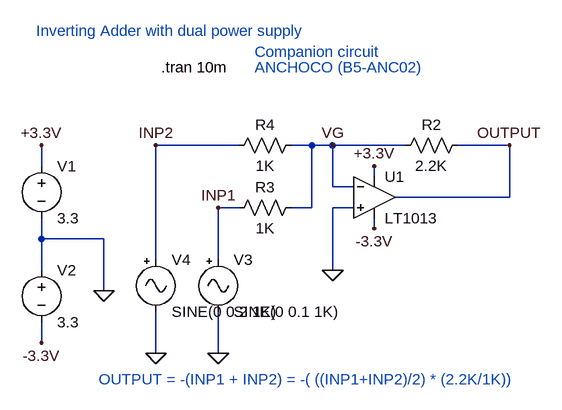
[diagram p0: schematic inverting_adder_with_dual_pow.asc]
inverting_adder_with_dual_pow.asc, the LTspice schematic file:
Version 4
SHEET 1 948 680
WIRE -240 0 -368 0
WIRE -128 0 -160 0
WIRE -96 0 -128 0
WIRE 16 0 -96 0
WIRE 176 0 96 0
WIRE -544 32 -544 0
WIRE -32 48 -32 32
WIRE -96 64 -96 0
WIRE -64 64 -96 64
WIRE 176 80 176 0
WIRE 176 80 0 80
WIRE -240 96 -272 96
WIRE -128 96 -128 0
WIRE -128 96 -160 96
WIRE -64 96 -96 96
WIRE -32 128 -32 112
WIRE -544 144 -544 112
WIRE -448 144 -544 144
WIRE -368 176 -368 0
WIRE -272 176 -272 96
WIRE -544 192 -544 144
WIRE -96 192 -96 96
WIRE -448 224 -448 144
WIRE -544 304 -544 272
WIRE -368 320 -368 256
WIRE -272 320 -272 256
FLAG -448 224 0
FLAG -544 0 +3.3V
FLAG -544 304 -3.3V
FLAG -32 32 +3.3V
FLAG -32 128 -3.3V
FLAG -272 320 0
FLAG 176 0 OUTPUT
FLAG -96 192 0
FLAG -368 320 0
FLAG -272 96 INP1
FLAG -368 0 INP2
FLAG -96 0 VG
SYMBOL voltage -544 16 R0
WINDOW 123 0 0 Left 0
WINDOW 39 0 0 Left 0
SYMATTR InstName V1
SYMATTR Value 3.3
SYMBOL voltage -544 176 R0
WINDOW 123 0 0 Left 0
WINDOW 39 0 0 Left 0
SYMATTR InstName V2
SYMATTR Value 3.3
SYMBOL res 0 16 R270
WINDOW 0 32 56 VTop 2
WINDOW 3 0 56 VBottom 2
SYMATTR InstName R2
SYMATTR Value 2.2K
SYMBOL Misc\\signal -272 160 R0
WINDOW 123 0 0 Left 0
WINDOW 39 0 0 Left 0
SYMATTR InstName V3
SYMATTR Value SINE(0 0.1 1K)
SYMBOL Opamps\\LT1013 -32 16 R0
SYMATTR InstName U1
SYMBOL Misc\\signal -368 160 R0
WINDOW 123 0 0 Left 0
WINDOW 39 0 0 Left 0
SYMATTR InstName V4
SYMATTR Value SINE(0 0.2 1K)
SYMBOL res -144 80 R90
WINDOW 0 0 56 VBottom 2
WINDOW 3 32 56 VTop 2
SYMATTR InstName R3
SYMATTR Value 1K
SYMBOL res -144 -16 R90
WINDOW 0 0 56 VBottom 2
WINDOW 3 32 56 VTop 2
SYMATTR InstName R4
SYMATTR Value 1K
TEXT -360 -120 Left 2 !.tran 10m
TEXT -552 -176 Left 2 ;Inverting Adder with dual power supply
TEXT -216 -120 Left 2 ;ANCHOCO (B5-ANC02)
TEXT -216 -144 Left 2 ;Companion circuit
TEXT -456 360 Left 2 ;OUTPUT = -(INP1 + INP2) = -( ((INP1+INP2)/2) * (2.2K/1K))

The netlist it stands for:
* inverting_adder_with_dual_pow.asc
V1 +3.3V 0 3.3
V2 0 -3.3V 3.3
R2 VG OUTPUT 2.2K
V3 INP1 0 SINE(0 0.1 1K)
XU1 0 VG +3.3V -3.3V OUTPUT LT1013  ; pins In+ In- V+ V- OUT
V4 INP2 0 SINE(0 0.2 1K)
R3 VG INP1 1K
R4 VG INP2 1K
.tran 10m
* Inverting Adder with dual power supply
* ANCHOCO (B5-ANC02)
* Companion circuit
* OUTPUT = -(INP1 + INP2) = -( ((INP1+INP2)/2) * (2.2K/1K))
.lib LTC.lib
.backanno
.end